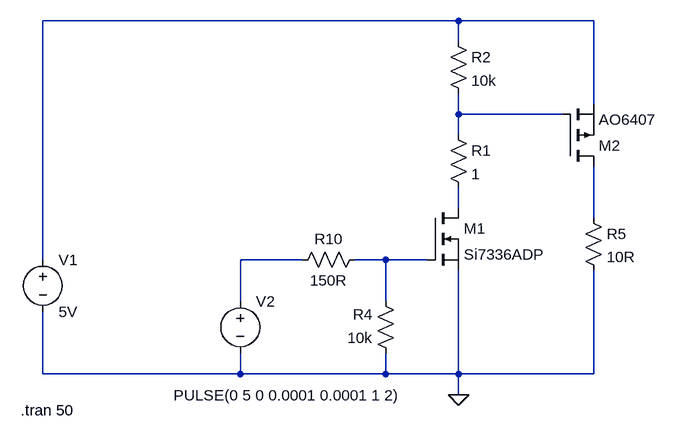
[diagram p0: schematic Draft1.asc]
Draft1.asc, the LTspice schematic file:
Version 4
SHEET 1 880 680
WIRE 96 -176 -544 -176
WIRE 304 -176 96 -176
WIRE 96 -144 96 -176
WIRE 304 -48 304 -176
WIRE 96 -32 96 -64
WIRE 256 -32 96 -32
WIRE 96 0 96 -32
WIRE 96 112 96 80
WIRE 304 128 304 48
WIRE -544 192 -544 -176
WIRE -144 192 -240 192
WIRE -16 192 -64 192
WIRE 48 192 -16 192
WIRE -240 256 -240 192
WIRE -16 256 -16 192
WIRE -544 368 -544 272
WIRE -240 368 -240 336
WIRE -240 368 -544 368
WIRE -16 368 -16 336
WIRE -16 368 -240 368
WIRE 96 368 96 208
WIRE 96 368 -16 368
WIRE 304 368 304 208
WIRE 304 368 96 368
WIRE 96 400 96 368
FLAG 96 400 0
SYMBOL nmos 48 112 R0
SYMATTR InstName M1
SYMATTR Value Si7336ADP
SYMBOL pmos 256 48 M180
SYMATTR InstName M2
SYMATTR Value AO6407
SYMBOL res 80 -160 R0
SYMATTR InstName R2
SYMATTR Value 10k
SYMBOL res -48 176 R90
WINDOW 0 0 56 VBottom 2
WINDOW 3 32 56 VTop 2
SYMATTR InstName R10
SYMATTR Value 150R
SYMBOL res 0 352 R180
WINDOW 0 36 76 Left 2
WINDOW 3 36 40 Left 2
SYMATTR InstName R4
SYMATTR Value 10k
SYMBOL res 288 112 R0
SYMATTR InstName R5
SYMATTR Value 10R
SYMBOL voltage -544 176 R0
WINDOW 123 0 0 Left 0
WINDOW 39 0 0 Left 0
SYMATTR InstName V1
SYMATTR Value 5V
SYMBOL voltage -240 240 R0
WINDOW 3 -103 161 Left 2
WINDOW 123 0 0 Left 0
WINDOW 39 0 0 Left 0
SYMATTR InstName V2
SYMATTR Value PULSE(0 5 0 0.0001 0.0001 1 2)
SYMBOL res 80 -16 R0
SYMATTR InstName R1
SYMATTR Value 1
TEXT -578 424 Left 2 !.tran 50

The netlist it stands for:
* Draft1.asc
M1 N003 N006 0 0 Si7336ADP
M2 N004 N002 N001 N001 AO6407
R2 N001 N002 10k
R10 N006 N005 150R
R4 0 N006 10k
R5 N004 0 10R
V1 N001 0 5V
V2 N005 0 PULSE(0 5 0 0.0001 0.0001 1 2)
R1 N002 N003 1
.model NMOS NMOS
.model PMOS PMOS
.lib standard.mos
.tran 50
.backanno
.end